# EAGLE design UBW32_v24 (EAGLE 5.02)
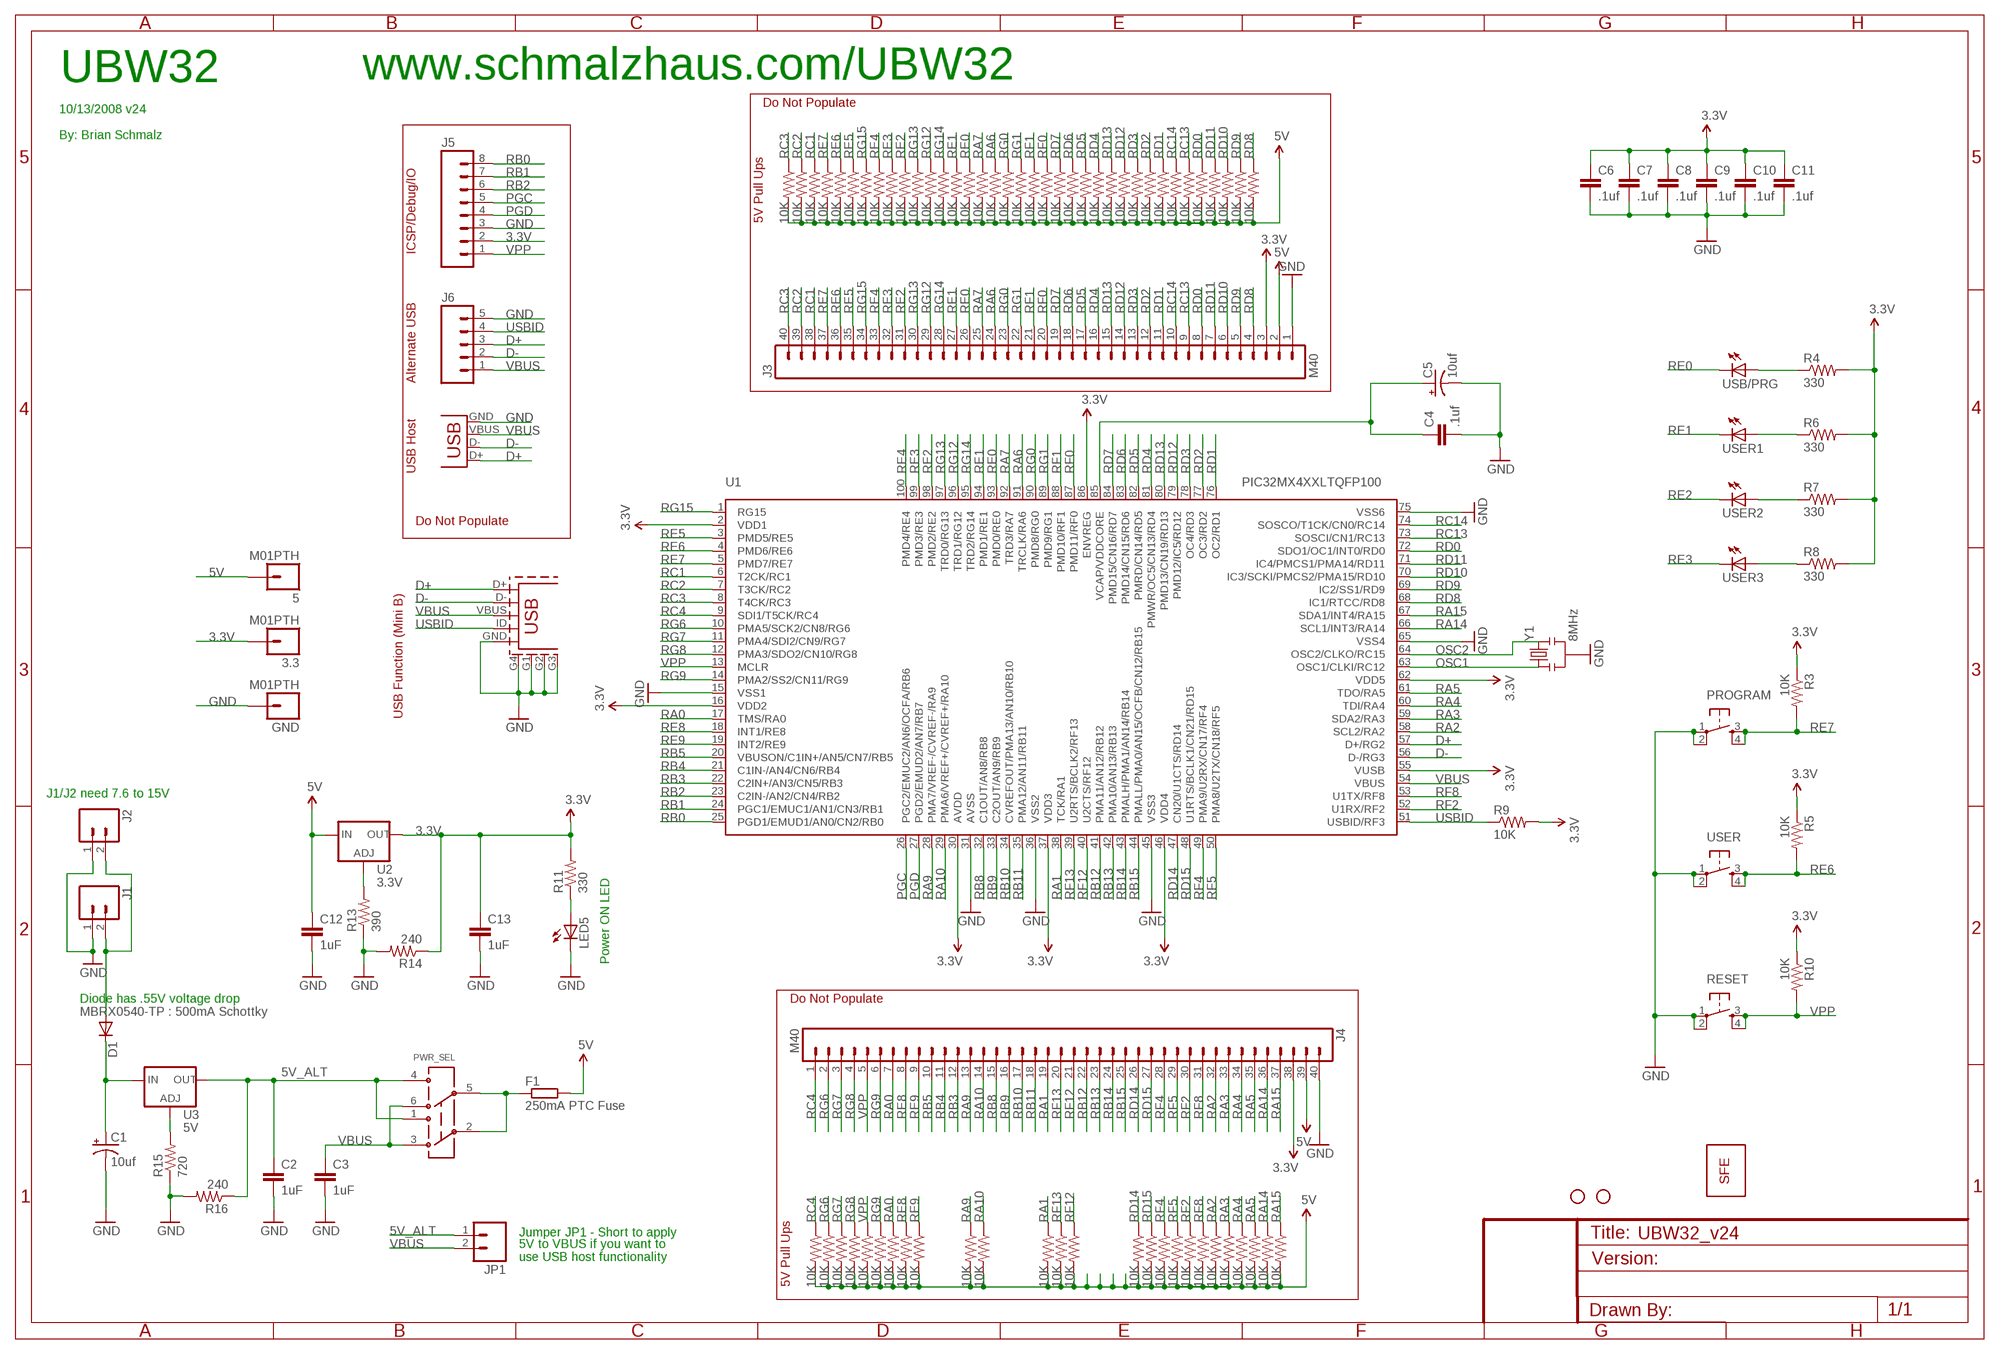
[diagram p0: schematic, sheet 1]

## Parts
3.3  M01PTH  [1X01]
5  M01PTH  [1X01]
C1  10uf  CAP_POL3528  [EIA3528]
C2  1uF  CAP0402  [C0402]
C3  1uF  CAP0402  [C0402]
C4  .1uf  CAP0402  [C0402]
C5  10uf  CAP_POL3528  [EIA3528]
C6  .1uf  CAP0402  [C0402]
C7  .1uf  CAP0402  [C0402]
C8  .1uf  CAP0402  [C0402]
C9  .1uf  CAP0402  [C0402]
C10  .1uf  CAP0402  [C0402]
C11  .1uf  CAP0402  [C0402]
C12  1uF  CAP0402  [C0402]
C13  1uF  CAP0402  [C0402]
D1  MBRX0540-TP : 500mA Schottky  DIODESOD  [SOD-323]
F1  250mA PTC Fuse  R-EU_R1206  [R1206]
GND  M01PTH  [1X01]
J1  M02PTH  [1X02]
J2  M02-JST-2MM-SMT  [S2B-PH]
J3  M40  [1X40]
J4  M40  [1X40]
J5  M08  [1X08]
J6  M05  [1X05]
J7  USB-A-S  [USB-A-S]
J8  USB_5PIN  [USB-MINIB]
JP1  M02PTH  [1X02]
LED5  LED0603  [LED-0603]
PROGRAM  TAC_SWITCHSND  [TACTILE_SWITCH_SMD]
PWR_SEL  AYZ0202  [AYZ0202]
R1  10K  RESISTOR  [0805]
R2  10K  RESISTOR  [0805]
R3  10K  RESISTOR0402  [C0402]
R4  330  RESISTOR0402  [C0402]
R5  10K  RESISTOR0402  [C0402]
R6  330  RESISTOR0402  [C0402]
R7  330  RESISTOR0402  [C0402]
R8  330  RESISTOR0402  [C0402]
R9  10K  RESISTOR0402  [C0402]
R10  10K  RESISTOR0402  [C0402]
R11  330  RESISTOR0402  [C0402]
R12  10K  RESISTOR  [0805]
R13  390  RESISTOR0402  [C0402]
R14  240  RESISTOR0402  [C0402]
R15  720  RESISTOR0402  [C0402]
R16  240  RESISTOR0402  [C0402]
R17  10K  RESISTOR  [0805]
R18  10K  RESISTOR  [0805]
R19  10K  RESISTOR  [0805]
R24  10K  RESISTOR  [0805]
R25  10K  RESISTOR  [0805]
R29  10K  RESISTOR  [0805]
R30  10K  RESISTOR  [0805]
R31  10K  RESISTOR  [0805]
R32  10K  RESISTOR  [0805]
R33  10K  RESISTOR  [0805]
R34  10K  RESISTOR  [0805]
R35  10K  RESISTOR  [0805]
R36  10K  RESISTOR  [0805]
R37  10K  RESISTOR  [0805]
R38  10K  RESISTOR  [0805]
R39  10K  RESISTOR  [0805]
R40  10K  RESISTOR  [0805]
R41  10K  RESISTOR  [0805]
R42  10K  RESISTOR  [0805]
R43  10K  RESISTOR  [0805]
R44  10K  RESISTOR  [0805]
R45  10K  RESISTOR  [0805]
R46  10K  RESISTOR  [0805]
R47  10K  RESISTOR  [0805]
R48  10K  RESISTOR  [0805]
R49  10K  RESISTOR  [0805]
R50  10K  RESISTOR  [0805]
R51  10K  RESISTOR  [0805]
R52  10K  RESISTOR  [0805]
R53  10K  RESISTOR  [0805]
R54  10K  RESISTOR  [0805]
R55  10K  RESISTOR  [0805]
R56  10K  RESISTOR  [0805]
R57  10K  RESISTOR  [0805]
R58  10K  RESISTOR  [0805]
R59  10K  RESISTOR  [0805]
R60  10K  RESISTOR  [0805]
R61  10K  RESISTOR  [0805]
R62  10K  RESISTOR  [0805]
R63  10K  RESISTOR  [0805]
R64  10K  RESISTOR  [0805]
R65  10K  RESISTOR  [0805]
R66  10K  RESISTOR  [0805]
R67  10K  RESISTOR  [0805]
R68  10K  RESISTOR  [0805]
R69  10K  RESISTOR  [0805]
R70  10K  RESISTOR  [0805]
R71  10K  RESISTOR  [0805]
R72  10K  RESISTOR  [0805]
R73  10K  RESISTOR  [0805]
R74  10K  RESISTOR  [0805]
R75  10K  RESISTOR  [0805]
R76  10K  RESISTOR  [0805]
R77  10K  RESISTOR  [0805]
R78  10K  RESISTOR  [0805]
R79  10K  RESISTOR  [0805]
R80  10K  RESISTOR  [0805]
R81  10K  RESISTOR  [0805]
R82  10K  RESISTOR  [0805]
R83  10K  RESISTOR  [0805]
RESET  TAC_SWITCHSND  [TACTILE_SWITCH_SMD]
U1  PIC32MX4XXLTQFP100  [TQFP100]
U2  3.3V  V_REG_317SMD  [SOT223]
U3  5V  V_REG_317SMD  [SOT223]
U$4  LOGO-SFENEW  [SFE-NEW-WEBLOGO]
U$6  STAND-OFF  [STAND-OFF]
U$7  STAND-OFF  [STAND-OFF]
USB/PRG  LED0603  [LED-0603]
USER  TAC_SWITCHSND  [TACTILE_SWITCH_SMD]
USER1  LED0603  [LED-0603]
USER2  LED0603  [LED-0603]
USER3  LED0603  [LED-0603]
Y1  8MHz  RESONATORSMD  [RESONATOR-SMD]

## Nets
3.3V: 3.3.1 C6.1 C7.1 C8.1 C9.1 C10.1 C11.1 C13.1 J3.3 J4.38 J5.2 R3.1 R4.2 R5.1 R6.2 R7.2 R8.2 R9.2 R10.1 R11.2 R14.1 U1.2(VDD1) U1.16(VDD2) U1.30(AVDD) U1.37(VDD3) U1.46(VDD4) U1.55(VUSB) U1.62(VDD5) U1.86(ENVREG) U2.2(OUT)
5V: 5.1 C12.1 F1.2 J3.2 J4.39 R1.2 R2.2 R12.2 R17.2 R18.2 R19.2 R24.2 R25.2 R29.2 R30.2 R31.2 R32.2 R33.2 R34.2 R35.2 R36.2 R37.2 R38.2 R39.2 R40.2 R41.2 R42.2 R43.2 R44.2 R45.2 R46.2 R47.2 R48.2 R49.2 R50.2 R51.2 R52.2 R53.2 R54.2 R55.2 R56.2 R57.2 R58.2 R59.2 R60.2 R61.2 R62.2 R63.2 R64.2 R65.2 R66.2 R67.2 R68.2 R69.2 R70.2 R71.2 R72.2 R73.2 R74.2 R75.2 R76.2 R77.2 R78.2 R79.2 R80.2 R81.2 R82.2 R83.2 U2.3(IN)
5V_ALT: C2.1 JP1.1 PWR_SEL.1 PWR_SEL.4 R16.1 U3.2(OUT)
D+: J6.3 J7.D+ J8.D+ U1.57(D+/RG2)
D-: J6.2 J7.D- J8.D- U1.56(D-/RG3)
GND: C1.C(-) C2.2 C3.2 C4.2 C5.C(-) C6.2 C7.2 C8.2 C9.2 C10.2 C11.2 C12.2 C13.2 GND.1 J1.1 J2.1 J3.1 J4.40 J5.3 J6.5 J7.GND J8.G1 J8.G2 J8.G3 J8.G4(SHIELD) J8.GND LED5.C PROGRAM.1 PROGRAM.2 R13.1 R14.2 R15.1 R16.2 RESET.1 RESET.2 U1.15(VSS1) U1.31(AVSS) U1.36(VSS2) U1.45(VSS3) U1.65(VSS4) U1.75(VSS6) USER.1 USER.2 Y1.2
N$1: D1.2(A) J1.2 J2.2
N$2: F1.1 PWR_SEL.2 PWR_SEL.5
N$3: R13.2 U2.1(ADJ)
N$4: R15.2 U3.1(ADJ)
N$6: LED5.A R11.1
N$20: R8.1 USER3.A
N$22: R7.1 USER2.A
N$23: R6.1 USER1.A
N$35: R4.1 USB/PRG.A
N$110: C4.1 C5.A(+) U1.85(VCAP/VDDCORE)
OSC1: U1.63(OSC1/CLKI/RC12) Y1.1
OSC2: U1.64(OSC2/CLKO/RC15) Y1.3
PGC: J5.5 U1.26(PGC2/EMUC2/AN6/OCFA/RB6)
PGD: J5.4 U1.27(PGD2/EMUD2/AN7/RB7)
RA0: J4.7 R31.1 U1.17(TMS/RA0)
RA1: J4.19 R19.1 U1.38(TCK/RA1)
RA2: J4.32 R69.1 U1.58(SCL2/RA2)
RA3: J4.33 R70.1 U1.59(SDA2/RA3)
RA4: J4.34 R80.1 U1.60(TDI/RA4)
RA5: J4.35 R81.1 U1.61(TDO/RA5)
RA6: J3.24 R46.1 U1.91(TRCLK/RA6)
RA7: J3.25 R45.1 U1.92(TRD3/RA7)
RA9: J4.13 R25.1 U1.28(PMA7/VREF-/CVREF-/RA9)
RA10: J4.14 R24.1 U1.29(PMA6/VREF+/CVREF+/RA10)
RA14: J4.36 R82.1 U1.66(SCL1/INT3/RA14)
RA15: J4.37 R83.1 U1.67(SDA1/INT4/RA15)
RB0: J5.8 U1.25(PGD1/EMUD1/AN0/CN2/RB0)
RB1: J5.7 U1.24(PGC1/EMUC1/AN1/CN3/RB1)
RB2: J5.6 U1.23(C2IN-/AN2/CN4/RB2)
RB3: J4.12 U1.22(C2IN+/AN3/CN5/RB3)
RB4: J4.11 U1.21(C1IN-/AN4/CN6/RB4)
RB5: J4.10 U1.20(VBUSON/C1IN+/AN5/CN7/RB5)
RB8: J4.15 U1.32(C1OUT/AN8/RB8)
RB9: J4.16 U1.33(C2OUT/AN9/RB9)
RB10: J4.17 U1.34(CVREFOUT/PMA13/AN10/RB10)
RB11: J4.18 U1.35(PMA12/AN11/RB11)
RB12: J4.22 U1.41(PMA11/AN12/RB12)
RB13: J4.23 U1.42(PMA10/AN13/RB13)
RB14: J4.24 U1.43(PMALH/PMA1/AN14/RB14)
RB15: J4.25 U1.44(PMALL/PMA0/AN15/OCFB/CN12/RB15)
RC1: J3.38 R62.1 U1.6(T2CK/RC1)
RC2: J3.39 R71.1 U1.7(T3CK/RC2)
RC3: J3.40 R75.1 U1.8(T4CK/RC3)
RC4: J4.1 R74.1 U1.9(SDI1/T5CK/RC4)
RC13: J3.9 R64.1 U1.73(SOSCI/CN1/RC13)
RC14: J3.10 R63.1 U1.74(SOSCO/T1CK/CN0/RC14)
RD0: J3.8 R65.1 U1.72(SDO1/OC1/INT0/RD0)
RD1: J3.11 R59.1 U1.76(OC2/RD1)
RD2: J3.12 R58.1 U1.77(OC3/RD2)
RD3: J3.13 R57.1 U1.78(OC4/RD3)
RD4: J3.16 R54.1 U1.81(PMWR/OC5/CN13/RD4)
RD5: J3.17 R53.1 U1.82(PMRD/CN14/RD5)
RD6: J3.18 R52.1 U1.83(PMD14/CN15/RD6)
RD7: J3.19 R51.1 U1.84(PMD15/CN16/RD7)
RD8: J3.4 R79.1 U1.68(IC1/RTCC/RD8)
RD9: J3.5 R78.1 U1.69(IC2/SS1/RD9)
RD10: J3.6 R77.1 U1.70(IC3/SCKI/PMCS2/PMA15/RD10)
RD11: J3.7 R76.1 U1.71(IC4/PMCS1/PMA14/RD11)
RD12: J3.14 R56.1 U1.79(PMD12/IC5/RD12)
RD13: J3.15 R55.1 U1.80(PMD13/CN19/RD13)
RD14: J4.26 R12.1 U1.47(CN20/U1CTS/RD14)
RD15: J4.27 R2.1 U1.48(U1RTS/BCLK1/CN21/RD15)
RE0: J3.26 R44.1 U1.93(PMD0/RE0) USB/PRG.C
RE1: J3.27 R43.1 U1.94(PMD1/RE1) USER1.C
RE2: J3.31 R39.1 U1.98(PMD2/RE2) USER2.C
RE3: J3.32 R38.1 U1.99(PMD3/RE3) USER3.C
RE4: J3.33 R37.1 U1.100(PMD4/RE4)
RE5: J3.35 R35.1 U1.3(PMD5/RE5)
RE6: J3.36 R5.2 R60.1 U1.4(PMD6/RE6) USER.3 USER.4
RE7: J3.37 PROGRAM.3 PROGRAM.4 R3.2 R61.1 U1.5(PMD7/RE7)
RE8: J4.8 R30.1 U1.18(INT1/RE8)
RE9: J4.9 R29.1 U1.19(INT2/RE9)
RF0: J3.20 R50.1 U1.87(PMD11/RF0)
RF1: J3.21 R49.1 U1.88(PMD10/RF1)
RF2: J4.30 R67.1 U1.52(U1RX/RF2)
RF4: J4.28 R1.1 U1.49(PMA9/U2RX/CN17/RF4)
RF5: J4.29 R66.1 U1.50(PMA8/U2TX/CN18/RF5)
RF8: J4.31 R68.1 U1.53(U1TX/RF8)
RF12: J4.21 R17.1 U1.40(U2CTS/RF12)
RF13: J4.20 R18.1 U1.39(U2RTS/BCLK2/RF13)
RG0: J3.23 R47.1 U1.90(PMD8/RG0)
RG1: J3.22 R48.1 U1.89(PMD9/RG1)
RG6: J4.2 R73.1 U1.10(PMA5/SCK2/CN8/RG6)
RG7: J4.3 R72.1 U1.11(PMA4/SDI2/CN9/RG7)
RG8: J4.4 R34.1 U1.12(PMA3/SDO2/CN10/RG8)
RG9: J4.6 R32.1 U1.14(PMA2/SS2/CN11/RG9)
RG12: J3.29 R41.1 U1.96(TRD1/RG12)
RG13: J3.30 R40.1 U1.97(TRD0/RG13)
RG14: J3.28 R42.1 U1.95(TRD2/RG14)
RG15: J3.34 R36.1 U1.1(RG15)
USBID: J6.4 J8.ID(USB_ID) R9.1 U1.51(USBID/RF3)
VBUS: C3.1 J6.1 J7.VBUS J8.VBUS JP1.2 PWR_SEL.3 PWR_SEL.6 U1.54(VBUS)
VIN_RAW: C1.A(+) D1.1(C) U3.3(IN)
VPP: J4.5 J5.1 R10.2 R33.1 RESET.3 RESET.4 U1.13(MCLR)

## Notes on the sheet
- UBW32 | www.schmalzhaus.com/UBW32
- Do Not Populate
- 10/13/2008 v24
- By: Brian Schmalz
- 5V Pull Ups
- ICSP/Debug/IO
- Alternate USB
- USB Host
- Do Not Populate
- USB Function (Mini B)
- J1/J2 need 7.6 to 15V
- Power ON LED
- Diode has .55V voltage drop | Do Not Populate
- Jumper JP1 - Short to apply
- 5V to VBUS if you want to
- use USB host functionality
- 5V Pull Ups

## Library data of the parts
3.3 5 GND = SparkFun02-20-08:M01: Header 1 Standard 1-pin 0.1" header. Use with straight break away headers (SKU : PRT-00116), right angle break away headers (PRT-00553), swiss pins (PRT-00743), machine pins (PRT-00117), and female headers (PRT-00115).
C1 C5 = SparkFun02-20-08:CAP_POL: Capacitor Polarized These are standard SMD and PTH capacitors. Normally 10uF, 47uF, and 100uF in electrolytic and tantalum varieties. Always verify the external diameter of the through hole cap, it varies with capacity, voltage, and manufacturer. The EIA devices should be standard.
C2-C4 C6-C13 = SparkFun02-20-08:CAP: Capacitor Standard 0603 ceramic capacitor, and 0.1" leaded capacitor.
D1 = SparkFun02-20-08:DIODE: Diode These are standard reverse protection diodes and small signal diodes. SMA package can handle up to about 1A. SOD-323 can handle about 200mA. What the SOD-323 package when ordering, there are some mfgs out there that are 5-pin packages.
F1 = resistor:R-EU_: RESISTOR, European symbol
J1 JP1 = SparkFun02-20-08:M02: Header 2 Standard 2-pin 0.1" header. Use with straight break away headers (SKU : PRT-00116), right angle break away headers (PRT-00553), swiss pins (PRT-00743), machine pins (PRT-00117), and female headers (PRT-00115). Molex polarized connector foot print use with SKU : PRT-08233 with associated crimp pins and housings.
J2 = SparkFun:M02: Header 2 Standard 2-pin 0.1" header. Use with straight break away headers (SKU : PRT-00116), right angle break away headers (PRT-00553), swiss pins (PRT-00743), machine pins (PRT-00117), and female headers (PRT-00115). Molex polarized connector foot print use with SKU : PRT-08233 with associated crimp pins and housings.
J3 J4 = SparkFun02-20-08:M40
J5 = SparkFun02-20-08:M08: Header 8 Standard 8-pin 0.1" header. Use with straight break away headers (SKU : PRT-00116), right angle break away headers (PRT-00553), swiss pins (PRT-00743), machine pins (PRT-00117), and female headers (PRT-00115).
J6 = SparkFun02-20-08:M05: Header 5 Standard 5-pin 0.1" header. Use with straight break away headers (SKU : PRT-00116), right angle break away headers (PRT-00553), swiss pins (PRT-00743), machine pins (PRT-00117), and female headers (PRT-00115). Molex polarized connector foot print use with SKU : PRT-08230 with associated crimp pins and housings.
J7 = SparkFun02-20-08:USB: USB Connectors USB-B-PTH is fully proven SKU : PRT-00139 USB-miniB is fully proven SKU : PRT-00587 USB-A-PCB is untested. USB-A-H is throughly reviewed, but untested. Spark Fun Electronics SKU : PRT-00437 USB-B-SMT is throughly reviewed, but untested. Needs silkscreen touching up. USB-A-S has not been used/tested USB-MB-H has not been used/tested
J8 = SparkFun02-20-08:USB_5PIN
LED5 USB/PRG USER1-USER3 = SparkFun02-20-08:LED: LEDs Standard schematic elements and footprints for 5mm, 3mm, 1206, and 0603 sized LEDs. 5mm - Spark Fun Electronics SKU : COM-00529 (and others)
PROGRAM RESET USER = SparkFun02-20-08:TAC_SWITCH: Momentary Switch Button commonly used for reset or general input. Spark Fun Electronics SKU : COM-00097
PWR_SEL = SparkFun02-20-08:AYZ0202: SPDT Slide Switch Simple SMD single-pull double-throw slide switch. Good for less than 350mA power switch, switching UARTs between devices, etc. Spark Fun Electronics SKU : COM-00597
R1-R19 R24 R25 R29-R83 = SparkFun02-20-08:RESISTOR: Resistor Basic schematic elements and footprints for 0603, 1206, and PTH 1/10th watt (small) resistors.
U1 = UBW32:PIC32MX4XXL
U2 U3 = SparkFun:V_REG_317: Voltage Regulator Standard LM317 adjustable voltage regulator. AOI (Adjust Output Input). Google 'LM317 Calculator' for easy to use app to get the two resistor values needed. 240/720 for 5V output. 240/390 for 3.3V output. Spark Fun Electronics SKU : COM-00527
U$4 = SparkFun02-20-08:LOGO-SFE: Spark Fun Electronics PCB Logo This is the standard Spark Fun Electronics PCB logo.
U$6 U$7 = SparkFun02-20-08:STAND-OFF: Stand Off This is the mechanical footprint for a #4 phillips button head screw. Use the keepout ring to avoid running the screw head into surrounding components. SKU : PRT-00447
Y1 = SparkFun02-20-08:RESONATOR: Resonator Small SMD resonator. This is the itty bitty 10/20MHz resonators with built in caps. CSTCE10M0G55 and CSTCE20M0V53. Footprint has been reviewed closely but hasn't been tested yet.

## Board
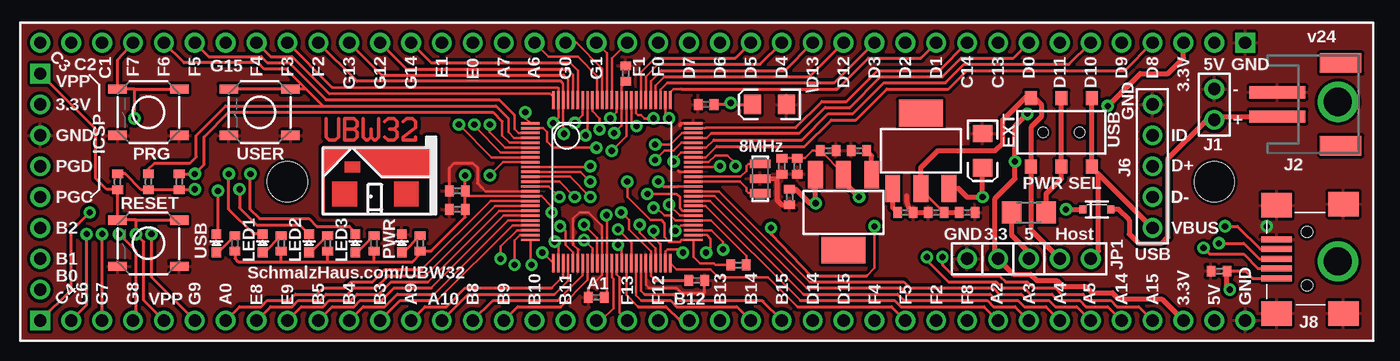
[diagram p1: board, top side]
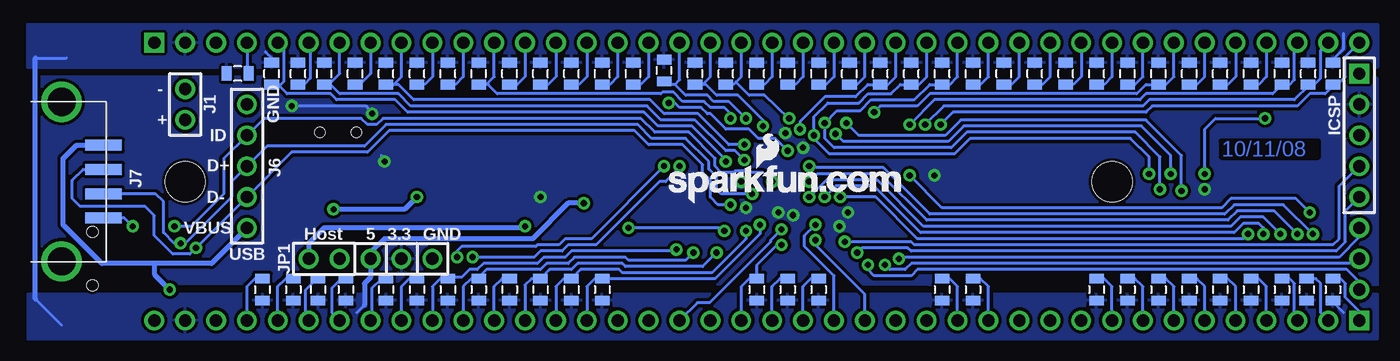
[diagram p2: board, bottom side, seen from below]

No outline drawn. Coordinates in mm, seen from the top.
Copper layers (1*16): Top 0.035mm / dielectric 1.5mm / Bottom 0.035mm
Design rules "SparkFun *": minimum track width 7mil, minimum drill 20mil, track to track 7mil, track to pad 7mil, pad to pad 7mil, via to via 8mil, smd to smd 8mil, copper to edge 10mil, drill to drill 8mil, minimum pad ring 12mil, minimum via ring 10mil, stop-mask expansion 4mil, vias tented up to drill 20mil, thermal gap 10mil

### Footprints (pad centres in the part's own frame; a part is rotated, then mirrored left to right if it is on the bottom)
1X01 = drill 1.016 round: 1 0,0
EIA3216 = smd 1.4 x 1.6: A 1.4,0; C -1.4,0
C0402 = smd 0.7 x 0.9: 1 -0.65,0; 2 0.65,0
SOD-323 = smd 0.559 x 0.686: 1 -1.15,0; 2 1.15,0
R1206 = smd 1.6 x 1.803: 1 -1.422,0; 2 1.422,0
1X02 = drill 1.016 round: 1 0,0; 2 2.54,0
S2B-PH = smd 1 x 4.6: 1 -1,-3.7; 2 1,-3.7 | smd 1.6 x 3.4: NC1 -3.4,1.5; NC2 3.4,1.5
1X40 = drill 1.016 square: 1 -49.53,0 | drill 1.016 round: 2 -46.99,0; 3 -44.45,0; 4 -41.91,0; 5 -39.37,0; 6 -36.83,0; 7 -34.29,0; 8 -31.75,0; 9 -29.21,0; 10 -26.67,0; 11 -24.13,0; 12 -21.59,0; 13 -19.05,0; 14 -16.51,0; 15 -13.97,0; 16 -11.43,0; 17 -8.89,0; 18 -6.35,0; 19 -3.81,0; 20 -1.27,0; 21 1.27,0; 22 3.81,0; 23 6.35,0; 24 8.89,0; 25 11.43,0; 26 13.97,0; 27 16.51,0; 28 19.05,0; 29 21.59,0; 30 24.13,0; 31 26.67,0; 32 29.21,0; 33 31.75,0; 34 34.29,0; 35 36.83,0; 36 39.37,0; 37 41.91,0; 38 44.45,0; 39 46.99,0; 40 49.53,0
1X08 = drill 1.016 square: 1 -8.89,0 | drill 1.016 round: 2 -6.35,0; 3 -3.81,0; 4 -1.27,0; 5 1.27,0; 6 3.81,0; 7 6.35,0; 8 8.89,0
1X05 = drill 1.016 round: 1 -5.08,0; 2 -2.54,0; 3 0,0; 4 2.54,0; 5 5.08,0
USB-A-S = smd 3 x 0.9: D+ 3.45,-1; D- 3.45,1; GND 3.45,-3; VBUS 3.45,3 | drill 2.311 round: P$5 0,-6.566; P$6 0,6.566
USB-MINIB = smd 2.5 x 0.5: D+ 2.5,0; D- 2.5,0.8; GND 2.5,-1.6; ID 2.5,-0.8; VBUS 2.5,1.6 | smd 2.5 x 2: G1 -3,4.5; G2 2.5,4.5; G3 -3,-4.5; G4 2.5,-4.4 | hole 0.9: 0,2.2; 0,-2.2
LED-0603 = smd 0.8 x 0.8: A 0,-0.75; C 0,0.75
TACTILE_SWITCH_SMD = smd 1.524 x 0.762: 1 -2.54,1.905; 2 2.54,1.905; 3 -2.54,-1.905; 4 2.54,-1.905
AYZ0202 = smd 1 x 1.15: 1 -2.5,2.825; 2 0,2.825; 3 2.5,2.825; 4 -2.5,-2.825; 5 0,-2.825; 6 2.5,-2.825 | hole 0.85: 1.5,0; -1.5,0
0805 = smd 0.8 x 1.2: 1 -0.9,0; 2 0.9,0
TQFP100 = smd 0.2 x 1.5: 1 -4.8,-6.7; 2 -4.4,-6.7; 3 -4,-6.7; 4 -3.6,-6.7; 5 -3.2,-6.7; 6 -2.8,-6.7; 7 -2.4,-6.7; 8 -2,-6.7; 9 -1.6,-6.7; 10 -1.2,-6.7; 11 -0.8,-6.7; 12 -0.4,-6.7; 13 0,-6.7; 14 0.4,-6.7; 15 0.8,-6.7; 16 1.2,-6.7; 17 1.6,-6.7; 18 2,-6.7; 19 2.4,-6.7; 20 2.8,-6.7; 21 3.2,-6.7; 22 3.6,-6.7; 23 4,-6.7; 24 4.4,-6.7; 25 4.8,-6.7; 51 4.8,6.7; 52 4.4,6.7; 53 4,6.7; 54 3.6,6.7; 55 3.2,6.7; 56 2.8,6.7; 57 2.4,6.7; 58 2,6.7; 59 1.6,6.7; 60 1.2,6.7; 61 0.8,6.7; 62 0.4,6.7; 63 0,6.7; 64 -0.4,6.7; 65 -0.8,6.7; 66 -1.2,6.7; 67 -1.6,6.7; 68 -2,6.7; 69 -2.4,6.7; 70 -2.8,6.7; 71 -3.2,6.7; 72 -3.6,6.7; 73 -4,6.7; 74 -4.4,6.7; 75 -4.8,6.7 | smd 1.5 x 0.2: 26 6.7,-4.8; 27 6.7,-4.4; 28 6.7,-4; 29 6.7,-3.6; 30 6.7,-3.2; 31 6.7,-2.8; 32 6.7,-2.4; 33 6.7,-2; 34 6.7,-1.6; 35 6.7,-1.2; 36 6.7,-0.8; 37 6.7,-0.4; 38 6.7,0; 39 6.7,0.4; 40 6.7,0.8; 41 6.7,1.2; 42 6.7,1.6; 43 6.7,2; 44 6.7,2.4; 45 6.7,2.8; 46 6.7,3.2; 47 6.7,3.6; 48 6.7,4; 49 6.7,4.4; 50 6.7,4.8; 76 -6.7,4.8; 77 -6.7,4.4; 78 -6.7,4; 79 -6.7,3.6; 80 -6.7,3.2; 81 -6.7,2.8; 82 -6.7,2.4; 83 -6.7,2; 84 -6.7,1.6; 85 -6.7,1.2; 86 -6.7,0.8; 87 -6.7,0.4; 88 -6.7,0; 89 -6.7,-0.4; 90 -6.7,-0.8; 91 -6.7,-1.2; 92 -6.7,-1.6; 93 -6.7,-2; 94 -6.7,-2.4; 95 -6.7,-2.8; 96 -6.7,-3.2; 97 -6.7,-3.6; 98 -6.7,-4; 99 -6.7,-4.4; 100 -6.7,-4.8
SOT223 = smd 1.219 x 2.235: 1 -2.311,-3.099; 2 0,-3.099; 3 2.311,-3.099 | smd 3.6 x 2.2: 4 0,3.099
STAND-OFF = hole 3.302: 0,0
RESONATOR-SMD = smd 0.7 x 1.7: 1 -1.2,0; 2 0,0; 3 1.2,0

### Placement (x,y rotation side)
3.3  80.01,6.35 0 top
5  82.55,6.35 0 top
C1  10uf  [EIA3216]  78.74,15.24 270 top
C2  77.47,10.16 0 top
C3  98.17,5.33 180 top
C4  56.01,19.05 180 top
C5  10uf  [EIA3216]  61.21,19.05 180 top
C6  49.4,21.59 90 top
C7  46.99,3.17 180 top
C8  35.56,10.41 180 top
C9  35.56,11.94 180 top
C10  63.5,13.97 270 top
C11  55.24,4.57 0 top
C12  62.87,11.43 270 top
C13  62.23,13.97 270 top
D1  88.14,10.41 0 top
F1  82.55,10.16 180 top
GND  77.47,6.35 0 top
J1  97.79,20.32 270 top
J2  106.68,19.05 270 top
J3  50.8,24.13 180 top
J4  50.8,1.27 0 top
J5  1.27,12.7 270 top
J6  92.71,13.97 90 top
J7  107.95,12.7 0 bottom
J8  105.41,6.35 180 top
JP1  85.09,6.35 0 top
LED5  30.99,7.62 0 top
PROGRAM  10.16,18.41 180 top
PWR_SEL  85.22,16.76 0 top
R1  68.58,3.81 270 bottom
R2  66.04,3.81 270 bottom
R3  12.7,12.7 90 top
R4  28.7,7.62 270 top
R5  10.16,12.7 90 top
R6  24.89,7.62 270 top
R7  21.08,7.62 270 top
R8  17.27,7.62 270 top
R9  58.67,5.84 0 top
R10  7.62,12.7 270 top
R11  32.51,7.62 270 top
R12  63.5,3.81 270 bottom
R13  68.58,15.24 0 top
R14  66.04,15.24 0 top
R15  72.39,10.16 180 top
R16  74.93,10.16 180 top
R17  50.8,3.81 270 bottom
R18  48.26,3.81 270 bottom
R19  45.72,3.81 270 bottom
R24  35.56,3.81 270 bottom
R25  33.02,3.81 270 bottom
R29  22.86,3.81 270 bottom
R30  20.32,3.81 270 bottom
R31  17.78,3.81 270 bottom
R32  15.24,3.81 270 bottom
R33  12.7,3.81 270 bottom
R34  10.16,3.81 270 bottom
R35  15.24,21.59 90 bottom
R36  17.78,21.59 90 bottom
R37  20.32,21.59 90 bottom
R38  22.86,21.59 90 bottom
R39  25.4,21.59 90 bottom
R40  27.94,21.59 90 bottom
R41  30.48,21.59 90 bottom
R42  33.02,21.59 90 bottom
R43  35.56,21.59 90 bottom
R44  38.1,21.59 90 bottom
R45  40.64,21.59 90 bottom
R46  43.18,21.59 90 bottom
R47  45.72,21.59 90 bottom
R48  48.26,21.59 90 bottom
R49  50.8,21.59 90 bottom
R50  53.34,21.59 90 bottom
R51  55.88,21.59 90 bottom
R52  58.42,21.84 90 bottom
R53  60.96,21.59 90 bottom
R54  63.5,21.59 90 bottom
R55  66.04,21.59 90 bottom
R56  68.58,21.59 90 bottom
R57  71.12,21.59 90 bottom
R58  73.66,21.59 90 bottom
R59  76.2,21.59 90 bottom
R60  12.7,21.59 90 bottom
R61  10.16,21.59 90 bottom
R62  7.62,21.59 90 bottom
R63  78.74,21.59 90 bottom
R64  81.28,21.59 90 bottom
R65  83.82,21.59 90 bottom
R66  71.12,3.81 270 bottom
R67  73.66,3.81 270 bottom
R68  76.2,3.81 270 bottom
R69  78.74,3.81 270 bottom
R70  81.28,3.81 270 bottom
R71  5.46,21.59 90 bottom
R72  7.62,3.81 270 bottom
R73  5.59,3.81 270 bottom
R74  3.43,3.81 270 bottom
R75  3.43,21.59 90 bottom
R76  86.36,21.59 90 bottom
R77  88.52,21.59 90 bottom
R78  90.68,21.59 90 bottom
R79  93.47,21.59 180 bottom
R80  84.58,3.81 270 bottom
R81  86.87,3.81 270 bottom
R82  88.9,3.81 270 bottom
R83  91.44,3.81 270 bottom
RESET  10.16,7.62 180 top
U1  48.26,12.7 270 top
U2  67.31,10.16 180 top
U3  73.66,15.24 0 top
U$3  [UBW32]  29.08,17.4 0 top
U$4  58.04,10.92 0 bottom
U$5  [SCHMALZHAUS]  28.32,12.57 0 top
U$6  97.79,12.7 0 top
U$7  21.59,12.7 0 top
USB/PRG  27.18,7.62 0 top
USER  19.3,18.41 180 top
USER1  23.37,7.62 0 top
USER2  19.56,7.62 0 top
USER3  15.75,7.62 0 top
Y1  60.45,12.95 90 top

### Tracks (layer width: path | path; a pad name or v marks a point on that pad's centre or on a via)
3.3V  (via drill 0.51)
  Top 0.203: 47.86,9.89 U1.37 47.86,3.41 | v48.45,16.7 49.06,17.31 U1.86 49.06,20.48 49.4,20.83 | v49.02,10.16 49.66,9.53 49.66,8.76 51.46,6.96 U1.46 51.46,4.93 51.82,4.57 | v43.31,10.16 43.31,10.67 42.48,11.5 U1.16 36.27,11.5 | v44.01,9.02 44.07,9.02 44.45,8.64 44.45,7.49 45.06,6.88 U1.30 | U1.2 42.59,17.1 42.93,16.76 42.93,16 43.43,15.49 v46.99,15.49 | 53.7,12.3 U1.62 | R9.2 59.32,6.59 56.41,9.5 U1.55 53.49,9.5 53.09,9.91 52.58,9.91 51.94,10.54 v51.69,10.54 | 65.41,15.24 67.31,13.34 | C10.1 63.5,14.61 63.48,14.62 C13.1 64.15,14.62 64.77,15.24 R14.1
  Top 0.254: 47.86,9.89 v47.82,9.93 | v36.2,13.21 36.21,13.19 C9.1 36.2,11.94 36.2,11.43 | 36.2,10.41 C8.1 | 36.2,10.41 36.2,11.43 | 36.2,11.43 36.27,11.5 | 49.4,20.83 C6.1 | R10.1 8.24,13.35 9.53,12.06 10.03,12.06 10.05,12.05 R5.1 R3.1 | R3.1 12.81,12.05 12.83,12.06 | R3.1 13.96,12.05 v13.97,12.06 | 36.2,10.41 36.2,9.78 33.4,6.99 32.51,6.99 R11.2 32.51,6.73 31.88,6.1 28.7,6.1 | 21.08,6.1 24.89,6.1 | 24.89,6.1 28.7,6.1 | 28.7,6.1 R4.2 | 24.89,6.1 R6.2 | 21.08,6.1 R7.2 | R8.2 17.27,6.37 17.54,6.1 21.08,6.1 | C7.1 47.62,3.17 47.86,3.41 | 54.61,4.57 C11.1 51.82,4.57 | 53.7,12.3 52.47,12.3 v52.07,12.7 | R14.1 65.41,15.24
  Top 0.406: J4.38 93.47,3.05 89.92,3.05 89.41,3.56 87.76,3.56 87.25,4.06 85.34,4.06 84.84,4.57 83.19,4.57 82.68,5.08 81.28,5.08 3.3.1 79.76,6.6 79.76,11.3 81.41,12.95 v81.41,14.35 81.41,17.27 v82.42,18.29 | J3.3 95.25,22.86 93.98,21.59 91.69,21.59 v89.03,18.92 | 67.31,13.34 U2.2 67.31,12.7 v68.58,11.43
  Bottom 0.254: v89.03,18.92 82.93,18.92 v82.42,18.29 | v81.41,14.35 81.66,14.86 81.53,14.73
  pour Bottom (isolate 0.254): -0.25,4.19 -0.25,21.21 110.74,21.34 110.74,4.32
5V  (via drill 0.51)
  Top 0.406: F1.2 81.13,8.28 82.55,6.86 5.1 | 65,12.06 65,10.95 v65.02,10.92 64.52,10.92 63.36,12.08 C12.1 | 65,12.06 U2.3 | 65,12.06 64.9,12.06 64.88,12.08
  Bottom 0.254: 83.06,2.54 83.69,1.91 | R74.2 3.43,2.79 2.54,1.91 | R75.2 3.43,22.73 2.54,23.62 2.54,24.89 | 110.11,22.86 107.57,22.86 | 107.95,0.89 110.11,3.05 | R78.2 90.68,22.86 91.19,23.37
  Bottom 0.406: 83.06,2.54 83.06,4.32 82.55,4.83 5.1 82.55,6.86 81.41,8 69.22,8 66.29,10.92 v65.02,10.92 | 110.11,3.05 110.11,22.86
  pour Bottom (isolate 0.254): -0.25,25.65 -0.25,22.1 110.74,22.1 110.74,25.65
  pour Bottom (isolate 0.254): -0.25,-0.25 -0.25,3.43 110.74,3.43 110.74,-0.25
5V_ALT
  Top 0.254: R16.1 75.56,10.16 73.66,12.06 U3.2
  Top 0.406: R16.1 C2.1 | JP1.1 82.72,8.72 PWR_SEL.4 82.72,17.18 83.57,18.03 83.57,19.05 83.03,19.59 PWR_SEL.1 82.2,19.59 80.39,17.78 80.39,15.88 79.76,15.24 75.06,15.24 73.66,13.84 U3.2
D+  (via drill 0.51)
  Top 0.203: U1.57 54.09,10.3 53.85,10.54 53.85,11.43 53.59,11.68 v51.18,11.68
  Top 0.254: J8.D+ 101.47,6.35 100.2,7.62 v98.17,7.62
  Bottom 0.254: J7.D+ 100.22,11.7 99.57,11.05 99.57,8.51 98.68,7.62 v98.17,7.62 97.79,7.62 93.98,11.43 93.98,12.7 J6.3 91.06,15.62 83.06,15.62 81.28,17.4 60.58,17.4 59.44,16.26 56.64,16.26 54.74,14.35 54.74,13.72 54.1,13.08 54.1,12.06 53.72,11.68 v51.18,11.68
D-  (via drill 0.51)
  Top 0.203: U1.56 53.85,9.9 v52.96,10.79
  Top 0.254: v96.9,7.24 97.28,6.86 | 97.28,6.86 97.32,6.82 | 97.28,6.86 97.41,6.73 100.2,6.73 101.38,5.55 J8.D-
  Bottom 0.254: J7.D- 106.19,13.7 107.06,12.83 107.06,11.3 106.43,10.67 101.09,10.67 100.33,9.91 100.33,8.26 98.81,6.73 97.41,6.73 v96.9,7.24 J6.2 89.03,15.11 82.8,15.11 81.03,16.89 60.83,16.89 59.69,15.75 56.9,15.75 55.24,14.1 55.24,13.46 54.61,12.83 54.61,11.43 53.98,10.79 v52.96,10.79
GND  (via drill 0.51)
  Top 0.203: U1.15 37.88,11.9 37.59,12.19 | U1.65 53.81,13.5 | 46.35,3.94 47.46,5.04 U1.36 47.46,9.05 46.35,10.16 45.59,10.16 45.09,9.65 45.09,7.49 45.46,7.12 U1.31 | U1.45 51.06,4.18 51.31,3.94 | U1.75 53.95,17.5
  Top 0.254: C9.2 34.91,13.83 35.31,14.22 36.83,14.22 37.21,13.84 37.21,12.57 37.59,12.19 | 53.91,17.34 54.08,17.5 | 53.91,17.34 53.85,17.27 | 53.81,13.5 53.72,13.59 | C7.2 46.35,3.17 46.35,3.94 | 51.31,3.94 53.59,3.94 53.98,3.56 55.88,3.56 C11.2 | 53.91,17.34 53.85,17.4 53.95,17.5
  Top 0.406: R16.2 R15.1 73.03,10.16 72.77,10.29 72.52,11.05 72.52,11.56 | C13.2 62.23,13.34 61.85,12.95 | Y1.2 61.85,12.95 | C12.2 62.24,10.78 61.85,11.18 61.85,12.95
  Bottom 0.254: 104.5,9.42 J7.GND 102.79,9.7 v102.11,9.02
  pour Top (isolate 0.254, rank 2): -0.25,25.65 -0.25,-0.25 110.74,-0.25 110.74,25.65
N$1
  Top 0.406: J2.2 98.06,18.05 J1.2 97.16,17.78 93.98,14.61 93.98,8.13 93.47,7.62 91.57,7.62 90.81,8.38 90.81,9.53 89.92,10.41 D1.2
N$2
  Top 0.406: PWR_SEL.2 PWR_SEL.5 85.22,12.95 83.97,11.71 F1.1
N$3
  Top 0.406: R13.2 69.22,15.24 69.62,14.83 U2.1
N$4
  Top 0.406: R15.2 71.75,10.16 71.35,10.57 U3.1
N$6
  Top 0.254: R11.1 32.51,8.26 31.13,6.87 LED5.A
N$20
  Top 0.254: USER3.A 15.89,6.87 17.27,8.26 17.14,8.26 17.16,8.27 R8.1
N$22
  Top 0.254: R7.1 21.08,8.26 19.7,6.87 USER2.A
N$23
  Top 0.254: R6.1 24.89,8.26 23.51,6.87 USER1.A
N$35
  Top 0.254: R4.1 28.7,8.26 27.32,6.87 USB/PRG.A
N$110  (via drill 0.51)
  Top 0.203: U1.85 49.46,16.44 v48.26,15.24
  Top 0.254: C5.A 59.69,19.18 59.69,19.05 58.04,19.05 | C4.1 56.64,18.8 56.9,19.05 58.04,19.05 | v58.04,19.18 58.04,19.05
  Bottom 0.254: v48.26,15.24 49.28,16.26 50.67,16.26 51.44,17.02 53.34,17.02 54.61,18.29 54.86,18.29 55.37,18.8 57.15,18.8 57.53,19.18 v58.04,19.18
OSC1
  Top 0.203: Y1.1 59.49,11.75 59.31,11.94 59.31,12.19 58.8,12.7 U1.63
OSC2
  Top 0.203: Y1.3 59.49,14.15 59.31,13.97 59.31,13.59 58.82,13.1 U1.64
PGC  (via drill 0.51)
  Top 0.203: U1.26 43.41,6 v42.55,6.86
  Bottom 0.254: J5.5 2.41,10.29 2.41,7.75 3.17,6.99 38.1,6.99 38.35,7.24 42.16,7.24 v42.55,6.86
PGD  (via drill 0.51)
  Top 0.203: U1.27 43.86,7.41 v43.56,7.75
  Bottom 0.254: v43.56,7.75 38.1,7.75 37.85,7.49 3.43,7.49 2.92,8 2.92,12.32 J5.4
RA0
  Top 0.203: U1.17 38.28,11.1 32.64,5.46
  Top 0.254: 32.64,5.46 29.59,5.46 28.57,4.45 26.8,4.45 26.29,3.94 24.51,3.94 24,3.43 22.23,3.43 21.72,2.92 19.94,2.92 19.43,2.41 17.65,2.41 J4.7
  Bottom 0.254: R31.1 17.16,4.71 16.51,4.06 J4.7
RA1
  Top 0.203: U1.38 48.26,4.83 48.39,4.7 48.39,2.29 47.37,1.27 J4.19
  Bottom 0.254: R19.1 46.37,4.71 46.37,4.69 46.99,4.06 J4.19
RA2
  Top 0.203: U1.58 55.98,10.7 63.75,2.92
  Top 0.254: 63.75,2.92 71.5,2.92 72.01,2.41 78.87,2.41 J4.32
  Bottom 0.254: R69.1 79.36,4.71 80.01,4.06 J4.32
RA3
  Top 0.203: U1.59 56.34,11.1 64.01,3.43
  Top 0.254: 64.01,3.43 71.75,3.43 72.26,2.92 79.12,2.92 79.63,2.41 81.41,2.41 J4.33
  Bottom 0.254: R70.1 81.65,4.71 82.42,3.94 82.42,1.4 J4.33
RA4
  Top 0.203: U1.60 56.7,11.5 64.26,3.94
  Top 0.254: 64.26,3.94 72.01,3.94 72.52,3.43 79.38,3.43 79.88,2.92 81.66,2.92 82.17,2.41 83.95,2.41 J4.34
  Bottom 0.254: R80.1 84.95,4.71 85.72,3.94 85.72,1.91 J4.34
RA5
  Top 0.203: U1.61 57.06,11.9 64.52,4.45
  Top 0.254: 64.52,4.45 72.26,4.45 72.77,3.94 79.63,3.94 80.14,3.43 81.92,3.43 82.42,2.92 84.2,2.92 84.71,2.41 86.49,2.41 J4.35
  Bottom 0.254: R81.1 86.98,4.71 87.88,3.81 87.88,1.52 J4.35
RA6
  Top 0.203: U1.91 47.06,21.39 45.47,22.99 43.05,22.99 J3.24
  Bottom 0.254: R46.1 42.56,20.69 41.91,21.34 J3.24
RA7  (via drill 0.51)
  Top 0.203: v47.24,17.02 47.24,17.91 46.66,18.49 U1.92
  Bottom 0.254: J3.25 39.37,21.34 40.02,20.69 R45.1 41.67,20.69 42.67,19.68 45.21,19.68 47.24,17.65 v47.24,17.02
RA9
  Top 0.203: U1.28 44.26,4.89 43.31,3.94
  Top 0.254: 43.31,3.94 36.2,3.94 34.67,2.41 32.89,2.41 J4.13
  Bottom 0.254: R25.1 32.4,4.71 31.75,4.06 J4.13
RA10
  Top 0.203: U1.29 44.66,4.53 43.56,3.43
  Top 0.254: 43.56,3.43 36.45,3.43 J4.14
  Bottom 0.254: R24.1 34.94,4.71 34.29,4.06 J4.14
RA14  (via drill 0.51)
  Top 0.203: U1.66 57.09,13.9
  Top 0.254: J4.36 89.03,2.41 87.25,2.41 86.74,2.92 84.96,2.92 84.45,3.43 82.68,3.43 82.17,3.94 80.39,3.94 79.88,4.45 75.95,4.45 74.17,6.22 v74.17,6.48 | 57.09,13.9 57.09,13.91 v57.15,13.97
  Bottom 0.254: v57.15,13.97 57.15,13.84 58.29,12.7 58.8,12.7 64.01,7.49 66.29,7.49 66.8,6.99 68.58,6.99 69.09,6.48 v74.17,6.48 | 88.9,4.83 R82.1 89.52,4.71 90.17,4.06 J4.36
RA15  (via drill 0.51)
  Top 0.203: U1.67 56.21,14.3 56.77,14.86 57.78,14.86 58.42,14.22 v58.42,13.97
  Top 0.254: J4.37 91.57,2.41 89.79,2.41 89.28,2.92 87.5,2.92 87,3.43 85.22,3.43 84.71,3.94 82.93,3.94 82.42,4.45 80.64,4.45 80.14,4.95 76.33,4.95 75.44,5.84 v75.44,6.48
  Bottom 0.254: v58.42,13.97 64.39,8 66.55,8 67.06,7.49 68.83,7.49 68.96,7.37 75.06,7.37 75.44,6.99 v75.44,6.48 | 91.44,4.83 R83.1 92.06,4.71 92.71,4.06 J4.37
RB0  (via drill 0.51)
  Top 0.203: U1.25 41.56,5.94 v41.66,5.84
  Bottom 0.254: J5.8 1.27,4.45 2.29,5.46 37.59,5.46 38.1,4.95 41.15,4.95 41.66,5.46 v41.66,5.84
RB1  (via drill 0.51)
  Top 0.203: U1.24 40.71,8.3 40.26,7.85 v40.26,5.84
  Bottom 0.254: v40.26,5.84 39.88,5.46 38.61,5.46 38.1,5.97 1.65,5.97 J5.7
RB2  (via drill 0.51)
  Top 0.203: U1.23 40.45,8.7 39.12,7.37 v39.12,6.35
  Bottom 0.254: v39.12,6.35 38.99,6.48 2.92,6.48 1.27,8.13 J5.6
RB3
  Top 0.203: U1.22 40.09,9.1 33.91,2.92
  Top 0.254: 33.91,2.92 30.86,2.92 J4.12
RB4
  Top 0.203: U1.21 39.73,9.5 33.66,3.43
  Top 0.254: 33.66,3.43 30.61,3.43 29.59,2.41 27.81,2.41 J4.11
RB5
  Top 0.203: U1.20 39.36,9.9 33.4,3.94
  Top 0.254: 33.4,3.94 30.35,3.94 29.34,2.92 27.56,2.92 27.05,2.41 25.27,2.41 J4.10
RB8
  Top 0.203: U1.32 45.86,4.97 43.81,2.92
  Top 0.254: 43.81,2.92 38.48,2.92 J4.15
RB9
  Top 0.203: U1.33 46.26,4.6 44.07,2.41
  Top 0.254: 44.07,2.41 40.51,2.41 J4.16
RB10  (via drill 0.51)
  Top 0.203: U1.34 46.66,7.19 v45.97,7.87
  Bottom 0.254: J4.17 41.91,3.43 45.97,7.49 v45.97,7.87
RB11  (via drill 0.51)
  Top 0.203: U1.35 47.06,8.06 v45.97,9.14
  Bottom 0.254: v45.97,9.14 46.86,8.26 46.86,7.37 44.45,4.95 J4.18
RB12
  Top 0.203: U1.41 49.46,3.37 50.42,2.41
  Top 0.254: 50.42,2.41 52.7,2.41 53.85,1.27 J4.22
RB13  (via drill 0.51)
  Top 0.203: U1.42 49.86,7.67 v48.77,8.76
  Bottom 0.254: J4.23 55.69,2.73 54.67,2.73 49.66,7.75 49.66,7.87 v48.77,8.76
RB14
  Top 0.203: U1.43 50.26,3.33 50.67,2.92
  Top 0.254: 50.67,2.92 53.09,2.92 53.59,2.41 58.55,2.41 J4.24
RB15
  Top 0.203: U1.44 50.66,3.7 50.93,3.43
  Top 0.254: 50.93,3.43 53.34,3.43 53.85,2.92 60.58,2.92 | 60.58,2.92 60.71,2.79 | 60.58,2.92 J4.25
RC1  (via drill 0.51)
  Top 0.203: U1.6 39.49,15.5 38.23,16.76 v38.23,17.4
  Bottom 0.254: J3.38 6.6,23.88 6.6,21.08 6.99,20.7 7.62,20.7 | 7.62,20.7 8.38,19.94 18.8,19.94 19.3,19.43 36.2,19.43 v38.23,17.4 | 7.62,20.7 R62.1
RC2  (via drill 0.51)
  Top 0.203: U1.7 39.13,15.1 37.08,17.14
  Top 0.254: v36.96,17.4 36.96,17.27 37.08,17.14
  Bottom 0.254: 5.33,20.7 4.95,20.7 4.45,21.21 4.45,23.5 J3.39 | 5.33,20.7 R71.1 | 5.33,20.7 6.6,19.43 18.54,19.43 19.05,18.92 35.43,18.92 v36.96,17.4
RC3  (via drill 0.51)
  Top 0.203: U1.8 38.39,14.7 v35.69,17.4
  Bottom 0.254: J3.40 2.41,22.99 2.41,21.34 3.06,20.69 R75.1 3.3,20.7 4.06,19.94 5.33,19.94 6.35,18.92 18.29,18.92 18.8,18.41 34.67,18.41 v35.69,17.4
RC4  (via drill 0.51, 0.51 pad 0.25)
  Top 0.203: U1.9 39.32,14.3 v38.23,13.21
  Top 0.254: J4.1 3.81,3.81 3.81,8.38 3.81,8.64 v5.33,10.16
  Bottom 0.254: R74.1 2.81,4.71 2.41,4.32 2.41,3.17 1.27,2.03 J4.1 | v38.23,13.21 35.56,10.54 12.57,10.54 11.81,11.3 6.48,11.3 v5.33,10.16
RC13  (via drill 0.51)
  Top 0.203: U1.73 54.04,16.7 53.09,15.75 v51.82,15.75
  Bottom 0.254: J3.9 80.01,21.34 80.66,20.69 R64.1 81.28,20.7 80.26,20.7 78.99,19.43 59.56,19.43 58.42,18.29 55.63,18.29 53.09,15.75 v51.82,15.75
RC14
  Top 0.203: 63.37,17.14 56.01,17.14 55.96,17.1 U1.74
  Top 0.254: 63.37,17.14 65.53,19.3 67.56,19.3 70.1,21.84 75.18,21.84 J3.10
  Bottom 0.254: R63.1 78.12,20.69 77.47,21.34 J3.10
RD0
  Top 0.203: U1.72 56.05,16.3 56.43,16.68
  Top 0.254: 56.43,16.68 63.67,16.68 65.79,18.8 67.82,18.8 70.36,21.34 75.44,21.34 76.96,22.86 81.28,22.86 J3.8
  Bottom 0.254: R65.1 83.45,20.69 82.55,21.59 J3.8
RD1
  Top 0.203: U1.76 53.06,20.04 53.34,20.32 53.98,20.32
  Top 0.254: 53.98,20.32 66.8,20.32 | 66.8,20.32 66.67,20.32 | 66.8,20.32 69.34,22.86 73.66,22.86 J3.11
  Bottom 0.254: R59.1 75.58,20.69 74.93,21.34 J3.11
RD2  (via drill 0.51)
  Top 0.203: U1.77 52.66,18.08
  Top 0.254: 52.66,18.08 v52.96,17.91
  Bottom 0.254: 73.2,20.69 73.04,20.69 72.39,21.34 J3.12 | 73.2,20.69 R58.1 | 73.2,20.69 72.89,20.69 72.14,19.94 58.67,19.94 58.55,20.07 57.66,20.07 56.9,19.3 55.12,19.3 54.61,18.8 53.47,18.8 52.96,18.29 v52.96,17.91
RD3
  Top 0.203: U1.78 52.26,20.26 52.83,20.83
  Top 0.254: 52.83,20.83 66.55,20.83 J3.13
  Bottom 0.254: R57.1 70.5,20.69 69.85,21.34 J3.13
RD4
  Top 0.203: U1.81 51.06,21.34 52.07,22.35
  Top 0.254: 52.07,22.35 60.45,22.35 J3.16
  Bottom 0.254: R54.1 62.88,20.69 62.23,21.34 J3.16
RD5
  Top 0.203: U1.82 50.66,21.7 51.82,22.86
  Top 0.254: 51.82,22.86 58.42,22.86 J3.17
  Bottom 0.254: R53.1 60.34,20.69 59.69,21.34 J3.17
RD6  (via drill 0.51)
  Top 0.203: v51.69,17.91 50.93,17.91 50.67,18.16 50.42,18.16 50.26,18.32 U1.83
  Bottom 0.254: 58.42,20.7 R52.1 58.42,20.95 58.17,20.7 57.53,20.7 | 57.53,20.7 57.15,21.08 J3.18 | v51.69,17.91 53.09,19.3 54.36,19.3 54.86,19.81 56.64,19.81 57.53,20.7
RD7  (via drill 0.51)
  Top 0.203: U1.84 49.86,17.7 v50.29,17.27
  Bottom 0.254: v50.29,17.27 50.29,17.78 52.32,19.81 54.1,19.81 54.99,20.7 55.88,20.7 R51.1 55.26,20.69 54.61,21.34 J3.19
RD8
  Top 0.203: U1.68 55.98,14.7 56.86,15.59
  Top 0.254: 56.86,15.59 64.1,15.59 66.29,17.78 68.33,17.78 70.87,20.32 75.95,20.32 77.47,21.84 90.42,21.84 J3.4
  Bottom 0.254: R79.1 92.34,21.58 92.71,22.23 J3.4
RD9  (via drill 0.51)
  Top 0.203: v53.34,14.35 53.34,14.48 53.96,15.1 U1.69
  Bottom 0.254: v53.34,14.35 53.34,14.48 56.13,17.27 58.93,17.27 60.07,18.41 79.5,18.41 80.52,19.43 85.34,19.43 85.85,19.94 89.41,19.94 90.04,20.57 90.55,20.57 90.68,20.7 R78.1 89.93,20.69 89.66,20.95 89.66,23.62 J3.5
RD10
  Top 0.203: U1.70 56.01,15.5 56.65,16.14
  Top 0.254: 56.65,16.14 63.89,16.14 66.04,18.29 68.07,18.29 70.61,20.83 75.69,20.83 77.22,22.35 85.85,22.35 J3.6
  Bottom 0.254: R77.1 88.02,20.69 87.5,21.21 87.5,24 J3.6
RD11  (via drill 0.51)
  Top 0.203: U1.71 54,15.9 53.34,15.24 52.58,15.24 v51.82,14.48
  Bottom 0.254: R76.1 85.99,20.69 85.09,21.59 J3.7 | v51.82,14.48 52.58,15.24 53.34,15.24 55.88,17.78 58.67,17.78 59.82,18.92 79.25,18.92 80.26,19.94 85.09,19.94 85.72,20.57 86.36,20.57 86.48,20.69 | R76.1 86.36,20.7 | 86.48,20.69 86.49,20.7 | 86.48,20.69 R76.1
RD12
  Top 0.203: U1.79 51.86,20.62 52.58,21.34
  Top 0.254: 52.58,21.34 64.52,21.34 J3.14
  Bottom 0.254: R56.1 67.96,20.69 67.31,21.34 J3.14
RD13
  Top 0.203: U1.80 51.46,20.98 52.32,21.84
  Top 0.254: 52.32,21.84 62.48,21.84 J3.15
  Bottom 0.254: R55.1 65.42,20.69 64.77,21.34 J3.15
RD14  (via drill 0.51)
  Top 0.203: v50.55,9.14 50.55,8.51 51.86,7.2 U1.47
  Bottom 0.254: J4.26 64.77,4.06 64.15,4.69 63.51,4.69 R12.1 | R12.1 | R12.1 54.23,4.7 50.55,8.38 v50.55,9.14
RD15  (via drill 0.51)
  Top 0.203: U1.48 52.26,7.56 52.2,7.62 51.69,8.13 v51.69,8.64
  Bottom 0.254: v51.69,8.64 51.69,8 54.48,5.21 61.85,5.21 62.1,5.46 65.28,5.46 R2.1 | R2.1 | R2.1 66.67,4.7 67.31,4.06 J4.27
RE0  (via drill 0.51)
  Top 0.203: U1.93 46.26,16.67 v46.1,16.51
  Top 0.254: v18.54,13.34 18.54,10.41 19.3,9.65 23.37,9.65 24,9.02 26.67,9.02 27.18,8.51 USB/PRG.C
  Bottom 0.254: J3.26 36.83,21.34 37.48,20.69 R44.1 38.1,20.7 38.99,20.7 39.75,19.94 41.66,19.94 42.42,19.18 44.96,19.18 46.1,18.03 v46.1,16.51 46.1,16.26 44.83,14.99 34.54,14.99 33.27,16.26 20.07,16.26 18.54,14.73 v18.54,13.34
RE1  (via drill 0.51)
  Top 0.203: U1.94 45.86,18.17 v45.21,17.53
  Top 0.254: v17.65,12.06 17.65,10.54 19.05,9.14 22.61,9.14 23.37,8.38 USER1.C
  Bottom 0.254: J3.27 34.29,21.34 34.94,20.69 R43.1 35.56,20.7 36.58,20.7 37.85,19.43 41.4,19.43 42.29,18.54 44.2,18.54 v45.21,17.53 45.21,16.26 44.45,15.49 34.8,15.49 33.53,16.76 19.68,16.76 17.65,14.73 v17.65,12.06
RE2  (via drill 0.51)
  Top 0.203: 44.07,20.95 44.26,20.76 U1.98 44.26,16.57
  Top 0.254: 44.07,20.95 27.3,20.95 J3.31 | v44.32,16.64 44.26,16.57 | v16.76,13.34 16.76,10.41 18.8,8.38 19.68,8.38 19.67,8.37 USER2.C
  Bottom 0.254: R39.1 24.78,20.69 24.13,21.34 J3.31 | v44.32,16.64 43.69,16 35.05,16 33.78,17.27 19.18,17.27 16.76,14.86 v16.76,13.34
RE3  (via drill 0.51)
  Top 0.203: 25.27,20.45 43.81,20.45 43.86,20.4 U1.99 43.86,17.95 v43.43,17.53
  Top 0.254: 25.27,20.45 J3.32 | v15.88,11.94 15.88,8.76 15.75,8.64 USER3.C
  Bottom 0.254: R38.1 22.24,20.69 21.59,21.34 J3.32 | v43.43,17.53 42.42,16.51 35.31,16.51 34.04,17.78 18.8,17.78 15.88,14.86 v15.88,11.94
RE4
  Top 0.203: U1.100 43.46,19.66 43.18,19.94 25.02,19.94
  Top 0.254: J3.33 20.19,22.99 21.97,22.99 25.02,19.94
  Bottom 0.254: R37.1 19.7,20.69 19.05,21.34 J3.33
RE5
  Top 0.203: U1.3 40.58,16.7 40.26,17.02 40.26,18.16
  Top 0.254: J3.35 15.11,22.99 19.43,22.99 19.94,22.48 21.72,22.48 24.77,19.43 38.99,19.43 40.26,18.16
  Bottom 0.254: R35.1 14.62,20.69 13.97,21.34 J3.35
RE6
  Top 0.203: U1.4 40.22,16.3 39.75,16.76 39.75,17.91
  Top 0.254: 24.51,18.92 38.73,18.92 39.75,17.91 | 23.11,20.32 21.46,21.97 19.68,21.97 19.18,22.48 13.08,22.48 J3.36 | 24.51,18.92 23.11,20.32 | USER.4 USER.3 23.11,20.32 | R5.2 10.16,13.72 10.67,14.22 13.59,14.22 14.1,14.73 14.1,16.51 16.51,18.92 24.51,18.92
  Bottom 0.254: J3.36 11.43,21.34 12.06,20.7 12.57,20.7 12.58,20.69 R60.1
RE7  (via drill 0.51)
  Top 0.203: U1.5 39.85,15.9 39.24,16.51 39.24,17.65
  Top 0.254: 9.02,20.32 PROGRAM.4 7.62,22.73 J3.37 | 9.02,20.32 PROGRAM.3 | 39.24,17.65 38.48,18.41 16.76,18.41 14.73,16.38 14.73,14.1 v13.97,13.34 12.7,13.34 R3.2 | v9.02,17.91 9.02,20.32
  Bottom 0.254: J3.37 8.89,21.34 9.53,20.7 10.16,20.7 R61.1 | v9.02,17.91 13.08,17.91 13.97,17.02 v13.97,13.34
RE8
  Top 0.203: U1.18 38.64,10.7 32.89,4.95
  Top 0.254: 32.89,4.95 29.84,4.95 28.83,3.94 27.05,3.94 26.54,3.43 24.77,3.43 24.26,2.92 22.48,2.92 21.97,2.41 20.19,2.41 J4.8
  Bottom 0.254: R30.1 19.7,4.71 19.05,4.06 J4.8
RE9
  Top 0.203: U1.19 39,10.3 33.15,4.45
  Top 0.254: 33.15,4.45 30.1,4.45 29.08,3.43 27.3,3.43 26.8,2.92 25.02,2.92 24.51,2.41 22.73,2.41 J4.9
  Bottom 0.254: R29.1 22.24,4.71 21.59,4.06 J4.9
RF0  (via drill 0.51)
  Top 0.203: U1.87 48.66,18.43 v48.13,17.91
  Bottom 0.254: R50.1 52.72,20.69 52.51,20.89 | 52.51,20.89 52.07,21.34 J3.20 | v48.13,17.91 50.16,19.81 51.44,19.81 52.51,20.89
RF1
  Top 0.203: U1.88 48.26,22.86 J3.21
  Bottom 0.254: R49.1 50.18,20.69 49.53,21.34 J3.21
RF2  (via drill 0.51)
  Top 0.203: U1.52 56.09,8.3 56.39,8 56.39,7.24 v56.01,6.86
  Bottom 0.254: v56.01,6.86 56.64,6.22 61.34,6.22 61.59,6.48 65.79,6.48 66.29,5.97 68.07,5.97 68.58,5.46 73.03,5.46 73.66,4.83 R67.1 74.28,4.71 74.93,4.06 J4.30
RF4  (via drill 0.51)
  Top 0.203: U1.49 52.66,6.94 52.83,7.11 53.85,7.11 v54.1,6.86
  Bottom 0.254: v54.1,6.86 55.24,5.71 61.59,5.71 61.85,5.97 65.53,5.97 66.04,5.46 67.82,5.46 R1.1 69.33,4.71 69.85,4.19 J4.28
RF5
  Top 0.203: 63.5,2.41 61.09,4.83 57.02,4.83 56.39,5.46 53.59,5.46 U1.50
  Top 0.254: 63.5,2.41 71.25,2.41 J4.29
  Bottom 0.254: R66.1 71.74,4.71 72.39,4.06 J4.29
RF8  (via drill 0.51)
  Top 0.203: U1.53 56.45,8.7 57.4,7.75 v57.4,7.11
  Bottom 0.254: v57.4,7.11 57.53,6.99 66.04,6.99 66.55,6.48 68.33,6.48 68.83,5.97 73.28,5.97 73.79,5.46 74.42,5.46 75.06,4.83 76.2,4.83 R68.1 76.82,4.71 77.47,4.06 J4.31
RF12  (via drill 0.51)
  Top 0.203: U1.40 49.06,7.2 v48.77,7.49
  Bottom 0.254: J4.21 52.07,4.06 51.42,4.71 R17.1 | R17.1 | R17.1 50.8,5.84 49.15,7.49 v48.77,7.49
RF13
  Top 0.203: U1.39 48.66,5.06 48.9,4.83 48.9,1.91 J4.20
  Bottom 0.254: J4.20 49.53,4.06 48.9,4.7 R18.1
RG0
  Top 0.203: U1.90 47.46,22.01 45.34,24.13 J3.23
  Bottom 0.254: R47.1 45.1,20.69 44.45,21.34 J3.23
RG1
  Top 0.203: U1.89 47.86,23.26 J3.22
  Bottom 0.254: R48.1 47.64,20.69 46.99,21.34 J3.22
RG6  (via drill 0.51)
  Top 0.203: 46.41,13.9 U1.10
  Top 0.254: v46.48,13.97 46.41,13.9 | v5.08,8.38 5.08,2.54 J4.2
  Bottom 0.254: R73.1 4.84,4.71 4.45,4.32 4.45,1.91 J4.2 | v46.48,13.97 46.35,13.84 40.39,13.84 36.58,10.03 12.32,10.03 11.56,10.79 7.49,10.79 v5.08,8.38
RG7  (via drill 0.51)
  Top 0.203: U1.11 45.68,13.5 v46.48,12.7
  Top 0.254: J4.3 v6.35,8.38
  Bottom 0.254: R72.1 7,4.71 6.6,4.32 6.6,1.52 J4.3 | v46.48,12.7 45.85,13.34 40.64,13.34 36.83,9.53 12.06,9.53 11.3,10.29 8.26,10.29 v6.35,8.38
RG8  (via drill 0.51)
  Top 0.203: U1.12 44.84,13.1 v46.48,11.43
  Top 0.254: J4.4 9.14,1.52 9.14,6.99 v7.75,8.38
  Bottom 0.254: R34.1 9.54,4.71 8.89,4.06 J4.4 | v7.75,8.38 9.14,9.78 11.05,9.78 11.81,9.02 37.08,9.02 40.89,12.83 45.09,12.83 v46.48,11.43
RG9  (via drill 0.51)
  Top 0.203: U1.14 43.07,12.3 v43.94,11.43
  Top 0.254: J4.6 10.41,4.83 v10.41,8.38
  Bottom 0.254: R32.1 14.62,4.71 13.97,4.06 J4.6 | v43.94,11.43 41.02,11.43 37.59,8 10.79,8 v10.41,8.38
RG12
  Top 0.203: U1.96 45.06,21.49 44.58,21.97
  Top 0.254: 44.58,21.97 31.37,21.97 J3.29
  Bottom 0.254: R41.1 29.86,20.69 29.21,21.34 J3.29
RG13
  Top 0.203: U1.97 44.66,21.13 44.32,21.46
  Top 0.254: 44.32,21.46 29.34,21.46 J3.30
  Bottom 0.254: R40.1 27.32,20.69 26.67,21.34 J3.30
RG14
  Top 0.203: U1.95 45.46,21.85 44.83,22.48
  Top 0.254: 44.83,22.48 33.4,22.48 J3.28
  Bottom 0.254: R42.1 32.4,20.69 31.75,21.34 J3.28
RG15  (via drill 0.51)
  Top 0.203: U1.1 41.15,17.91 v41.15,18.41
  Bottom 0.254: J3.34 16.51,21.34 17.16,20.69 R36.1 17.78,20.7 18.8,20.7 19.56,19.94 36.58,19.94 37.59,18.92 40.64,18.92 v41.15,18.41
USBID  (via drill 0.51)
  Top 0.203: R9.1 56.77,5.84 56.64,5.97 55.5,5.97 54.96,6.51 U1.51 54,7.9 53.85,7.75 52.96,7.75 52.58,8.13 52.58,9.27 52.32,9.53 51.44,9.53 49.53,11.43 v49.53,12.7
  Top 0.254: J8.ID 101.56,7.15 99.69,9.02 v98.68,9.02
  Bottom 0.254: v98.68,9.02 97.28,9.02 94.61,11.68 94.61,14.61 J6.4 91.31,17.91 83.31,17.91 82.8,17.4 82.04,17.4 81.53,17.91 60.33,17.91 59.18,16.76 56.39,16.76 54.23,14.61 54.23,13.97 53.72,13.46 52.7,13.46 52.58,13.59 51.69,13.59 51.56,13.46 50.29,13.46 v49.53,12.7
VBUS  (via drill 0.51)
  Top 0.203: U1.54 53.93,9.1 v53.47,8.64 | v69.85,9.02 69.85,5.59 69.22,4.95
  Top 0.254: 87.76,13.97 87.63,13.97 87.66,13.94 PWR_SEL.6 87.76,13.97 | 87.76,13.97 87.72,14.01 | 87.76,13.84 87.76,13.97 | v61.34,8.89 61.34,8.38 64.64,4.95 69.22,4.95 | J8.VBUS 100.91,4.75 100.33,5.33 C3.1 98.81,5.33
  Top 0.406: 87.72,14.01 PWR_SEL.3 | JP1.2 88.27,6.99 88.27,13.34 | C3.1 98.82,4.05 v99.06,3.81 | 88.27,13.34 87.76,13.84 | PWR_SEL.6 87.81,13.84 87.88,13.84 87.88,13.72 | 88.27,13.34 J6.1
  Bottom 0.254: v61.34,8.89 53.72,8.89 v53.47,8.64
  Bottom 0.406: J6.1 95.63,5.97 100.33,5.97 | J7.VBUS 106.73,15.7 107.82,14.61 107.82,9.14 104.65,5.97 100.33,5.97 | 100.33,5.97 100.33,5.08 v99.06,3.81 | JP1.2 87.63,7.62 86.36,8.89 69.98,8.89 v69.85,9.02
VIN_RAW  (via drill 0.51)
  Top 0.406: C1.A v78.74,11.43 77.47,11.43 76.76,12.14 U3.3 | v85.6,10.41 D1.1
  Bottom 0.406: v85.6,10.41 79.76,10.41 v78.74,11.43
VPP  (via drill 0.51)
  Top 0.203: U1.13 43.94,12.7 v45.21,11.43
  Top 0.254: 9.14,9.53 RESET.4 7.49,9.53 7.62,9.65 R10.2 7.62,12.06 6.73,12.06 5.84,12.95 5.84,17.02 J5.1 | 9.14,9.53 RESET.3 | 9.14,9.53 v9.14,8.38 9.78,7.75 9.78,2.92 J4.5
  Bottom 0.254: R33.1 12.08,4.71 11.43,4.06 J4.5 | v45.21,11.43 44.32,12.32 41.15,12.32 37.34,8.51 11.56,8.51 10.79,9.27 9.53,9.27 9.14,8.89 v9.14,8.38

### Text on the board
Bottom: 10/11/08
tPlace: v24 | C1 | F7 | F6 | F5 | F4 | F3 | F2 | G13 | G12 | G14 | E1 | E0 | A7 | A6 | G0 | G1 | F1 | F0 | D7 | D6 | D5 | D4 | \D13 | D12 | D3 | D2 | D1 | C14 | C13 | D0 | D11 | D10 | D9 | D8 | 3.3V | C3 | C2 | G15 | 5V | GND | VPP | - | 3.3V | GND | + | GND | 8MHz | ID | ICSP | EXT | USB | J1 | PRG | USER | D+ | J2 | PGD | J6 | PWR SEL | PGC | D- | D- | RESET | B2 | GND | 3.3 | 5 | Host | VBUS | USB | B1 | USB | LED1 | LED2 | LED3 | PWR | SchmalzHaus.com/UBW32 | A1 | JP1 | B0 | A10 | G6 | G7 | G8 | VPP | G9 | A0 | E8 | E9 | B5 | B4 | B3 | A9 | B8 | B9 | B10 | B11 | F13 | F12 | B12 | B13 | B14 | B15 | D14 | D15 | F4 | F5 | F2 | F8 | A2 | A3 | A4 | A5 | A14 | A15 | 3.3V | 5V | GND | C4 | J8
bPlace: ICSP | - | GND | J1 | + | ID | D+ | J6 | J7 | D- | GND | 3.3 | 5 | Host | VBUS | USB | JP1